# EAGLE design LickSensor-2ch (EAGLE 9.1.1)
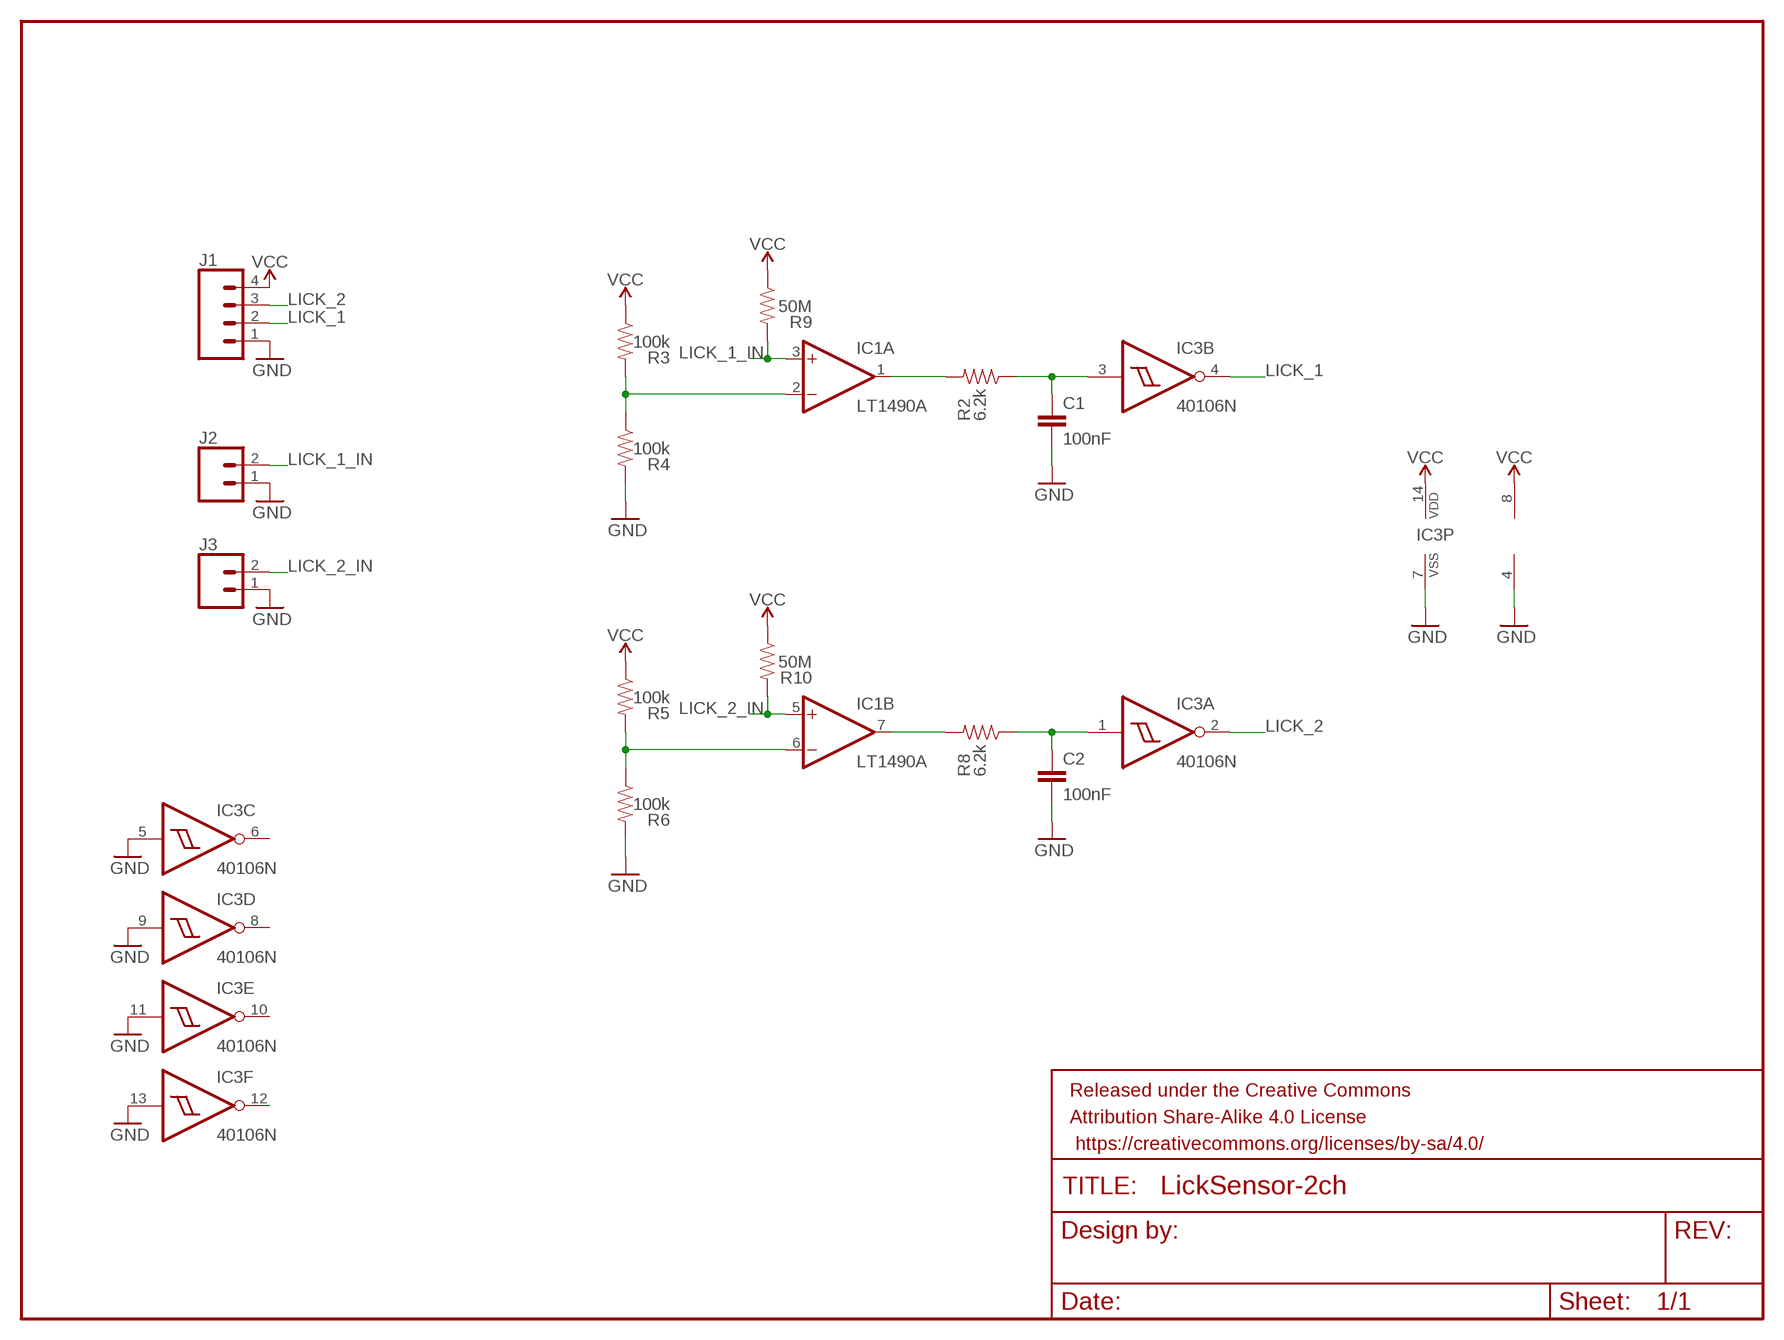
[diagram p0: schematic, sheet 1]

## Parts
C1  100nF  C5/3  [C5B3]
C2  100nF  C5/3  [C5B3]
FRAME1  FRAME-LETTER  [CREATIVE_COMMONS]
IC1  LT1490A  OPA2277P  [DIL08]
IC3  40106N  [DIL14]
J1  CONN_04  [1X04]
J2  CONN_02  [1X02]
J3  CONN_02  [1X02]
R2  6.2k  RESISTORPTH-1/2W  [AXIAL-0.5]
R3  100k  RESISTORPTH-1/2W  [AXIAL-0.5]
R4  100k  RESISTORPTH-1/2W  [AXIAL-0.5]
R5  100k  RESISTORPTH-1/2W  [AXIAL-0.5]
R6  100k  RESISTORPTH-1/2W  [AXIAL-0.5]
R8  6.2k  RESISTORPTH-1/2W  [AXIAL-0.5]
R9  50M  RESISTORPTH-1/2W  [AXIAL-0.5]
R10  50M  RESISTORPTH-1/2W  [AXIAL-0.5]

## Nets
GND: C1.2 C2.2 IC1.4(P:V-) IC3.5(C:I) IC3.7(P:VSS) IC3.9(D:I) IC3.11(E:I) IC3.13(F:I) J1.1 J2.1 J3.1 R4.P$2 R6.P$2
LICK_1: IC3.4(B:O) J1.2
LICK_1_IN: IC1.3(A:+IN) J2.2 R9.P$2
LICK_2: IC3.2(A:O) J1.3
LICK_2_IN: IC1.5(B:+IN) J3.2 R10.P$2
N$1: C1.1 IC3.3(B:I) R2.P$1
N$2: IC1.1(A:OUT) R2.P$2
N$3: IC1.2(A:-IN) R3.P$2 R4.P$1
N$8: IC1.6(B:-IN) R5.P$2 R6.P$1
N$9: C2.1 IC3.1(A:I) R8.P$1
N$10: IC1.7(B:OUT) R8.P$2
VCC: IC1.8(P:V+) IC3.14(P:VDD) J1.4 R3.P$1 R5.P$1 R9.P$1 R10.P$1
Unconnected: IC3.6(C:O) IC3.8(D:O) IC3.10(E:O) IC3.12(F:O)

## Library data of the parts
C1 C2 = capacitor-wima:C: CAPACITOR naming: grid - package width
FRAME1 = SparkFun-Aesthetics:FRAME-LETTER: Schematic Frame - Letter Standard 8.5x11 US Letter frame
IC1 = linear:OPA2277: High Precision OPERATIONAL AMPLIFIERS REPLACES OP-07, OP-77, OP-177 Source: opa277.pdf
IC3 = 40xx:40106: Hex SCHMITT TRIGGER
J1 = SparkFun-Connectors:CONN_04: Multi connection point. Often used as Generic Header-pin footprint for 0.1 inch spaced/style header connections On any of the 0.1 inch spaced packages, you can populate with these: Break Away Headers - Straight <https://www.sparkfun.com/products/116> (PRT-00116) Break Away Male Headers - Right Angle <https://www.sparkfun.com/products/553> (PRT-00553) Female Headers <https://www.sparkfun.com/products/115> (PRT-00115) Break Away Headers - Machine Pin <https://www.sparkfun.com/products/117> (PRT-00117) Break Away Female Headers - Swiss Machine Pin <https://www.sparkfun.com/products/743> (PRT-00743) For SCREWTERMINALS and SPRING TERMINALS visit here: Screw Terimnals on SparkFun.com <https://www.sparkfun.com/search/results?term=Screw+Terminals> (5mm/3.5mm/2.54mm spacing) This device is also useful as a general connection point to wire up your design to another part of your project. Our various solder wires solder well into these plated through hole pads. Hook-Up Wire - Assortment (Stranded, 22 AWG) <https://www.sparkfun.com/products/11375> (PRT-11375) Hook-Up Wire - Assortment (Solid Core, 22 AWG) <https://www.sparkfun.com/products/11367> (PRT-11367) View the entire wire category on our website here <https://www.sparkfun.com/categories/141> Special notes: Molex polarized connector foot print use with SKU : PRT-08231 with associated crimp pins and housings. 1MM SMD Version SKU: PRT-10208; PROD_ID: CONN-09696
J2 J3 = SparkFun-Connectors:CONN_02: Multi connection point. Often used as Generic Header-pin footprint for 0.1 inch spaced/style header connections On any of the 0.1 inch spaced packages, you can populate with these: Break Away Headers - Straight <https://www.sparkfun.com/products/116> (PRT-00116) Break Away Male Headers - Right Angle <https://www.sparkfun.com/products/553> (PRT-00553) Female Headers <https://www.sparkfun.com/products/115> (PRT-00115) Break Away Headers - Machine Pin <https://www.sparkfun.com/products/117> (PRT-00117) Break Away Female Headers - Swiss Machine Pin <https://www.sparkfun.com/products/743> (PRT-00743) For SCREWTERMINALS and SPRING TERMINALS visit here: Screw Terimnals on SparkFun.com <https://www.sparkfun.com/search/results?term=Screw+Terminals> (5mm/3.5mm/2.54mm spacing) This device is also useful as a general connection point to wire up your design to another part of your project. Our various solder wires solder well into these plated through hole pads. Hook-Up Wire - Assortment (Stranded, 22 AWG) <https://www.sparkfun.com/products/11375> (PRT-11375) Hook-Up Wire - Assortment (Solid Core, 22 AWG) <https://www.sparkfun.com/products/11367> (PRT-11367) View the entire wire category on our website here <https://www.sparkfun.com/categories/141> Special notes: Molex polarized connector foot print use with: PRT-08233 with associated crimp pins and housings. 2.54_SCREWTERM for use with PRT-10571. 3.5mm Screw Terminal footprints for PRT-08084 5mm Screw Terminal footprints for use with PRT-08432
R2-R6 R8-R10 = SparkFun-Resistors:RESISTOR: Resistor Basic schematic elements and footprints for 0603, 1206, and PTH resistors.

## Net classes
0 default: width 0.305 mm, clearance 0.305 mm

## Board
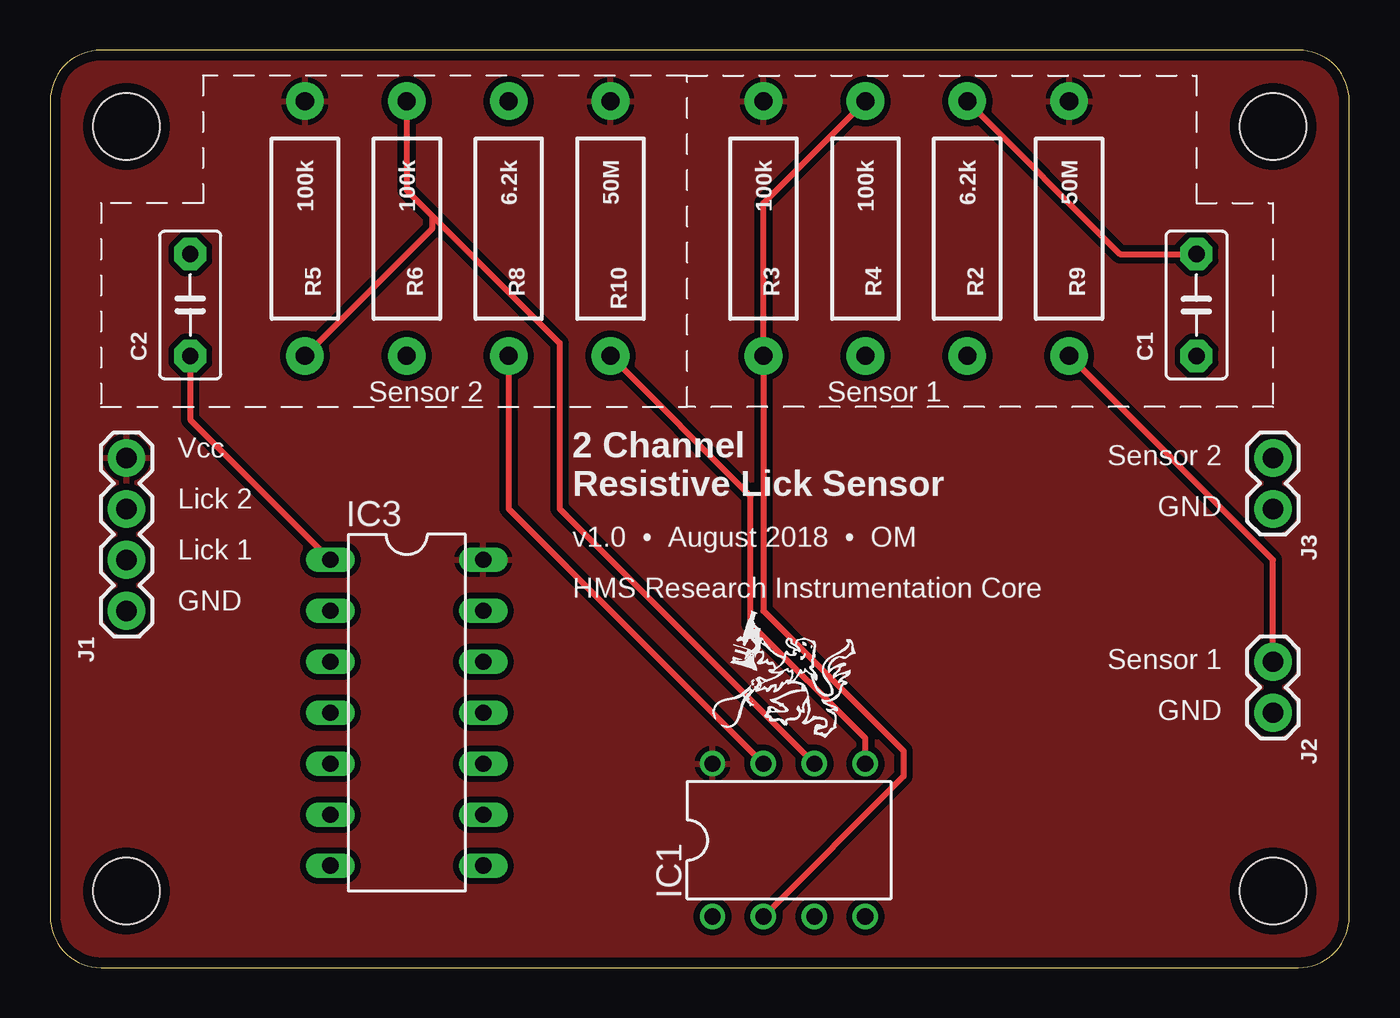
[diagram p1: board, top side]
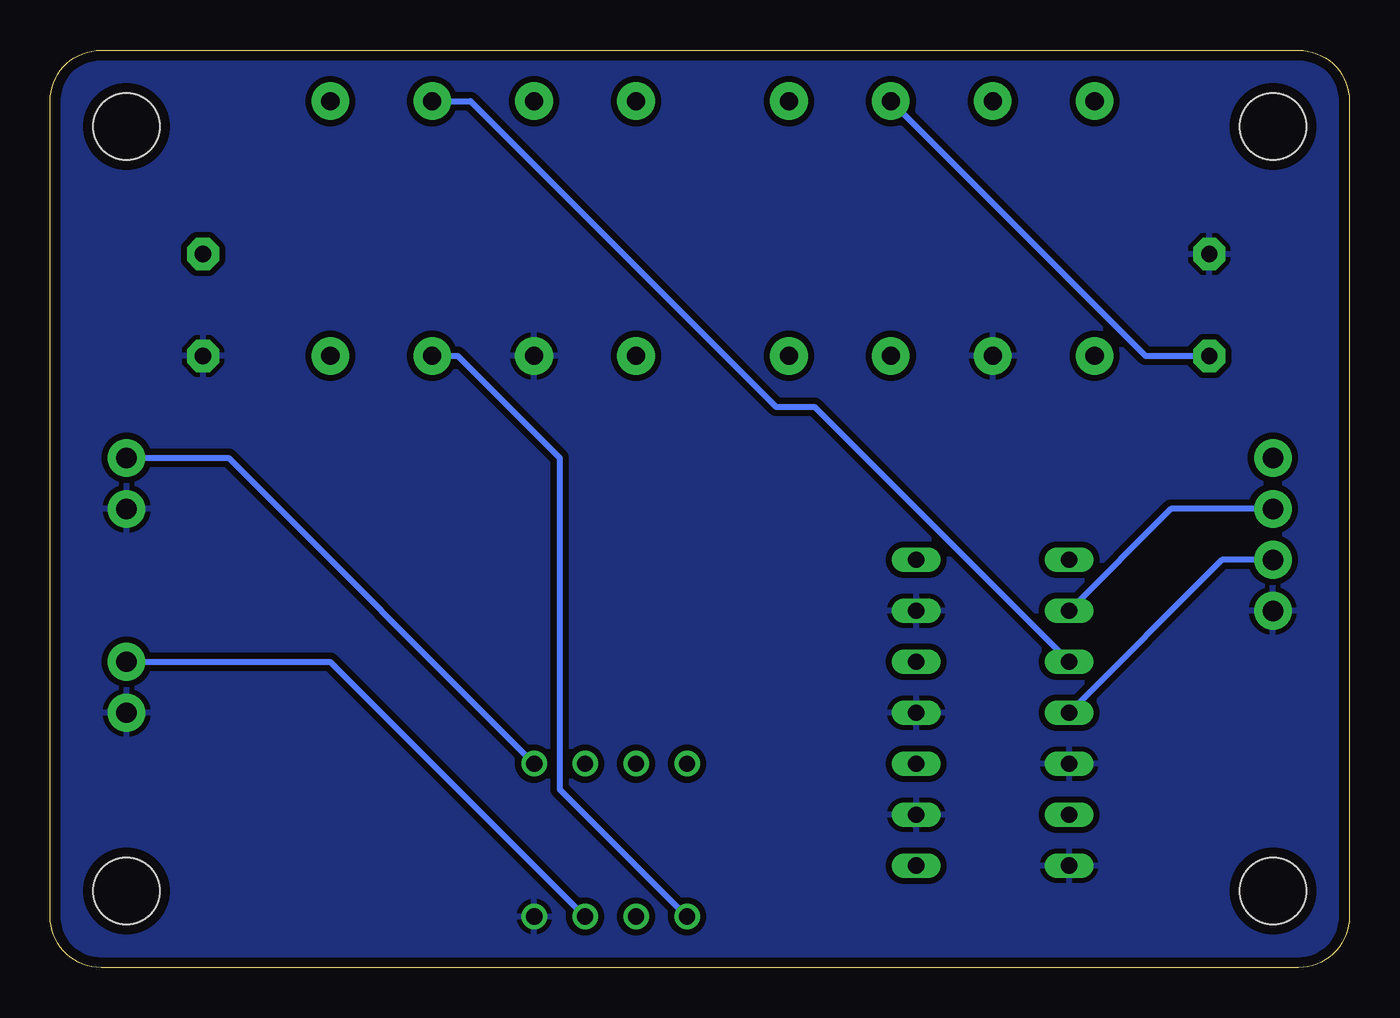
[diagram p2: board, bottom side, seen from below]

Size 64.77 x 45.72 mm. Coordinates in mm from the lower left corner, seen from the top.
Outline: 0,43.18 0,2.54 arc90 2.54,0 62.23,0 arc90 64.77,2.54 64.77,43.18 arc90 62.23,45.72 2.54,45.72 arc90 0,43.18
Copper layers (1*16): Top 0.0178mm / dielectric 59mil / Bottom 0.0178mm
Design rules "SSC-EAGLE-2Lyr_v1.0.0.3": minimum track width 6mil, minimum drill 14mil, track to track 6mil, track to pad 6mil, pad to pad 6mil, via to via 6mil, smd to smd 6mil, copper to edge 20mil, drill to drill 16mil, minimum pad ring 8mil, minimum via ring 8mil, stop-mask expansion 3mil, vias tented up to drill 0mil, thermal gap 10mil

### Footprints (pad centres in the part's own frame; a part is rotated, then mirrored left to right if it is on the bottom)
C5B3 = drill 0.813 pad 1.6 octagon: 1 -2.54,0; 2 2.54,0
DIL08 = drill 0.813 pad 1.27: 1 -3.81,-3.81; 2 -1.27,-3.81; 3 1.27,-3.81; 4 3.81,-3.81; 5 3.81,3.81; 6 1.27,3.81; 7 -1.27,3.81; 8 -3.81,3.81
DIL14 = drill 0.813 long: 1 -7.62,-3.81; 2 -5.08,-3.81; 3 -2.54,-3.81; 4 0,-3.81; 5 2.54,-3.81; 6 5.08,-3.81; 7 7.62,-3.81; 8 7.62,3.81; 9 5.08,3.81; 10 2.54,3.81; 11 0,3.81; 12 -2.54,3.81; 13 -5.08,3.81; 14 -7.62,3.81
1X04 = drill 1.016 pad 1.88: 1 0,0; 2 2.54,0; 3 5.08,0; 4 7.62,0
1X02 = drill 1.016 pad 1.88: 1 0,0; 2 2.54,0
AXIAL-0.5 = drill 0.9 pad 1.88: P$1 -6.35,0; P$2 6.35,0
STAND-OFF = hole 3.302: 0,0

### Placement (x,y rotation side)
C1  57.15,33.02 270 top
C2  6.99,33.02 90 top
FRAME1  22.86,-10.16 0 top  (outside the outline)
IC1  36.83,6.35 0 top
IC3  17.78,12.7 270 top
J1  3.81,17.78 90 top
J2  60.96,12.7 90 top
J3  60.96,22.86 90 top
R2  45.72,36.83 270 top
R3  35.56,36.83 270 top
R4  40.64,36.83 270 top
R5  12.7,36.83 270 top
R6  17.78,36.83 270 top
R8  22.86,36.83 270 top
R9  50.8,36.83 270 top
R10  27.94,36.83 270 top
U$1  [STAND-OFF]  3.81,3.81 0 top
U$2  [STAND-OFF]  60.96,41.91 0 top
U$3  [STAND-OFF]  3.81,41.91 0 top
U$4  [STAND-OFF]  60.96,3.81 0 top
U$5  [RIC_LOGO_SMALL]  33.02,11.43 0 top

### Tracks (layer width: path | path; a pad name or v marks a point on that pad's centre or on a via)
GND
  pour Bottom: 0,45.72 64.77,45.72 64.77,0 0,0
LICK_1
  Bottom 0.305: IC3.4 6.35,20.32 J1.2
LICK_1_IN
  Top 0.305: R9.P$2 60.96,20.32 J2.2
  Bottom 0.305: IC1.3 50.8,15.24 J2.2
LICK_2
  Bottom 0.305: IC3.2 8.89,22.86 J1.3
LICK_2_IN
  Top 0.305: R10.P$2 34.92,23.5 34.92,17.14 40.64,11.43 IC1.5
  Bottom 0.305: IC1.5 55.88,25.4 J3.2
N$1
  Top 0.305: C1.1 53.34,35.56 R2.P$1
  Bottom 0.305: IC3.3 26.67,27.94 28.57,27.94 43.81,43.18 R2.P$1
N$2
  Bottom 0.305: IC1.1 39.37,8.89 39.37,25.4 44.45,30.48 R2.P$2
N$3
  Top 0.305: IC1.2 42.55,9.53 42.55,10.79 35.56,17.78 R3.P$2 35.56,38.1 R4.P$1
N$8
  Top 0.305: IC1.6 25.4,22.86 25.4,31.11 19.05,37.47 | 19.05,37.47 17.78,38.73 R6.P$1 | R5.P$2 19.05,36.83 19.05,37.47
N$9
  Top 0.305: C2.1 6.99,27.3 IC3.1
  Bottom 0.305: R8.P$1 10.16,30.48 C2.1
N$10
  Top 0.305: IC1.7 22.86,22.86 R8.P$2
VCC
  pour Top: 0,45.72 64.77,45.72 64.77,0 0,0

### Text on the board
tPlace: Sensor 2 | Sensor 1 | Sensor 2 | Vcc | Lick 2 | 2 Channel / Resistive Lick Sensor | GND | v1.0 • August 2018 • OM | Lick 1 | GND | HMS Research Instrumentation Core | Sensor 1 | GND